# EAGLE schematic firefist (EAGLE 8.2.1)
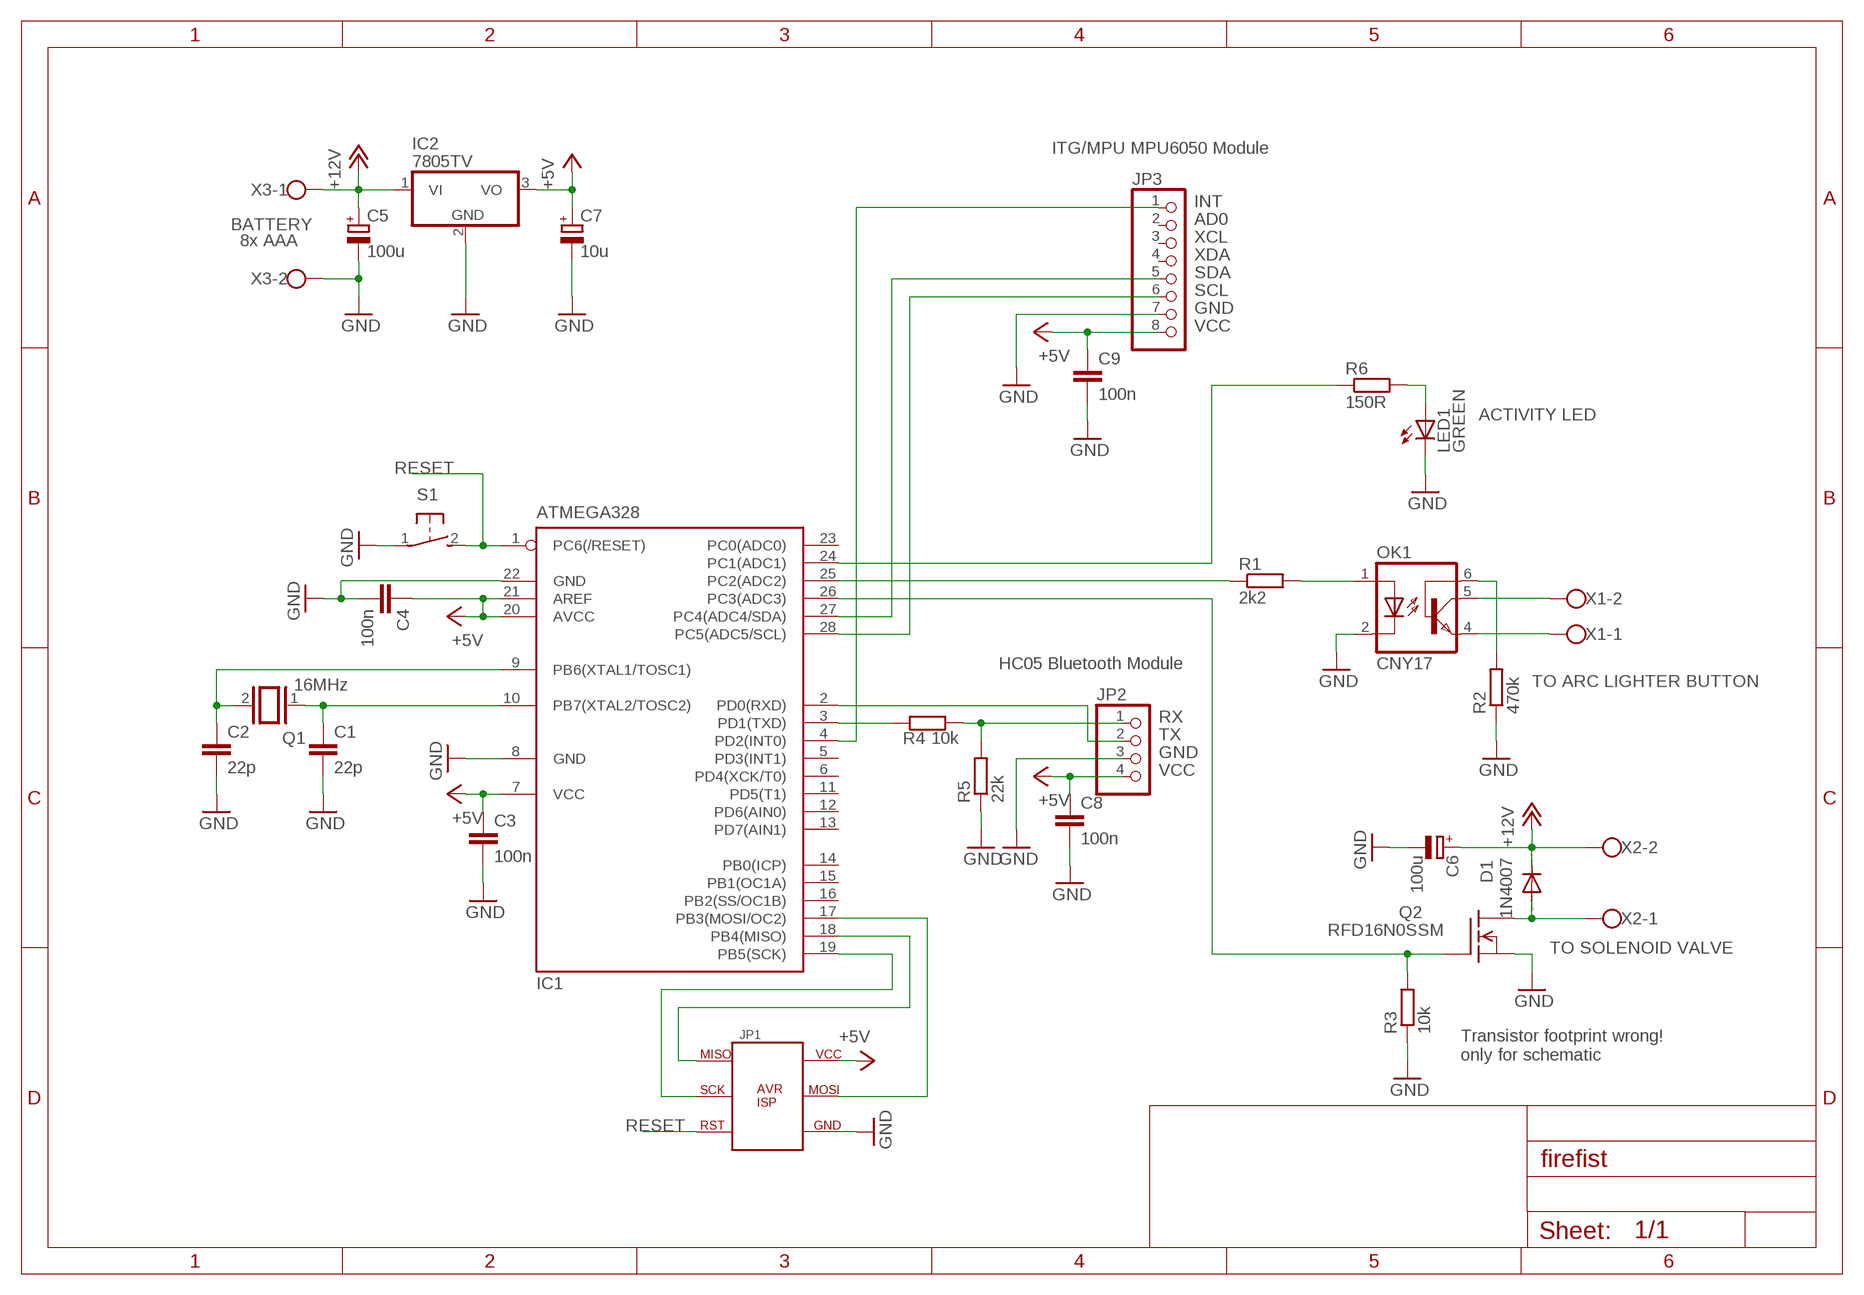
[diagram p0: schematic, sheet 1]

## Parts
C1  22p  C-EU025-024X044  [C025-024X044]
C2  22p  C-EU025-024X044  [C025-024X044]
C3  100n  C-EU025-024X044  [C025-024X044]
C4  100n  C-EU025-024X044  [C025-024X044]
C5  100u  CPOL-EUE5-13  [E5-13]
C6  100u  CPOL-EUE5-13  [E5-13]
C7  10u  CPOL-EUE2.5-7  [E2,5-7]
C8  100n  C-EU025-024X044  [C025-024X044]
C9  100n  C-EU025-024X044  [C025-024X044]
D1  1N4007  1N4004  [DO41-10]
IC1  ATMEGA328  MEGA8-P  [DIL28-3]
IC2  7805TV  [TO220V]
JP1  AVR_ISPSINGLESIDED_SMD  [PINHEADER_254_2X3_SMD]
JP2  PINHD-1X4  [1X04]
JP3  PINHD-1X8  [1X08]
LED1  GREEN  LED5MM  [LED5MM]
OK1  CNY17  [DIL06]
Q1  16MHz  XTAL/S  [QS]
Q2  RFD16N0SSM  BUZ11  [TO220]
R1  2k2  R-EU_0204/7  [0204/7]
R2  470k  R-EU_0204/7  [0204/7]
R3  10k  R-EU_0204/7  [0204/7]
R4  10k  R-EU_0204/7  [0204/7]
R5  22k  R-EU_0204/7  [0204/7]
R6  150R  R-EU_0204/7  [0204/7]
S1  31-XX  [B3F-31XX]
X1  W237-102  [W237-102]
X2  W237-102  [W237-102]
X3  W237-102  [W237-102]

## Nets
+5V: C3.1 C4.1 C7.+ C8.1 C9.1 IC1.7(VCC) IC1.20(AVCC) IC1.21(AREF) IC2.3(VO) JP1.P$8(VCC) JP2.4
+12V: C5.+ C6.+ D1.C IC2.1(VI) X2.2 X3.1
GND: C1.2 C2.2 C3.2 C4.2 C5.- C6.- C7.- C8.2 C9.2 IC1.8(GND) IC1.22(GND) IC2.2(GND) JP1.P$6(GND) JP2.3 JP3.7 LED1.K(C) OK1.2(C) Q2.3(S) R2.1 R3.1 R5.1 S1.1(P) X3.2
N$1: C2.1 IC1.9(PB6(XTAL1/TOSC1)) Q1.2
N$2: C1.1 IC1.10(PB7(XTAL2/TOSC2)) Q1.1
N$3: IC1.17(PB3(MOSI/OC2)) JP1.P$7(MOSI)
N$4: IC1.18(PB4(MISO)) JP1.P$1(MISO)
N$5: IC1.19(PB5(SCK)) JP1.P$2(SCK)
N$6: IC1.25(PC2(ADC2)) R1.1
N$7: OK1.1(A) R1.2
N$8: OK1.4(EMI) X1.1
N$9: OK1.5(COL) X1.2
N$10: OK1.6(BAS) R2.2
N$11: D1.A Q2.2(D) X2.1
N$12: IC1.26(PC3(ADC3)) Q2.1(G) R3.2
N$13: IC1.4(PD2(INT0)) JP3.1
N$14: IC1.27(PC4(ADC4/SDA)) JP3.5
N$15: IC1.28(PC5(ADC5/SCL)) JP3.6
N$16: IC1.2(PD0(RXD)) JP2.2
N$17: IC1.3(PD1(TXD)) R4.1
N$18: JP2.1 R4.2 R5.2
N$19: IC1.24(PC1(ADC1)) R6.1
N$20: LED1.A R6.2
RESET: IC1.1(PC6(/RESET)) JP1.P$3(RST) S1.2(S)
Unconnected: IC1.5(PD3(INT1)) IC1.6(PD4(XCK/T0)) IC1.11(PD5(T1)) IC1.12(PD6(AIN0)) IC1.13(PD7(AIN1)) IC1.14(PB0(ICP)) IC1.15(PB1(OC1A)) IC1.16(PB2(SS/OC1B)) IC1.23(PC0(ADC0)) JP3.2 JP3.3 JP3.4 JP3.8

## Notes on the sheet
- ITG/MPU MPU6050 Module
- INT
- AD0
- BATTERY
- 8x AAA | XCL
- XDA
- SDA
- SCL
- GND
- VCC
- ACTIVITY LED
- HC05 Bluetooth Module
- TO ARC LIGHTER BUTTON
- RX
- TX
- GND
- VCC
- TO SOLENOID VALVE
- Transistor footprint wrong!
  only for schematic

## Library data of the parts
C1-C4 C8 C9 = rcl:C-EU: CAPACITOR, European symbol
C5-C7 = rcl:CPOL-EU: POLARIZED CAPACITOR, European symbol
D1 = diode:1N4004: DIODE general purpose rectifier, 1 A
IC1 = atmel:MEGA8-P: MICROCONTROLLER 8 Kbytes FLASH, 1 kbytes SRAM, 512 bytes EEPROM, USART, 4-channel 10 bit ADC, 2-channel 8 bit ADC Pin compatible with Atmega48, ATMega88, ATMega168 Source: avr.lbr; OC_FARNELL: unknown; OC_NEWARK: unknown
IC2 = linear:78*: Positive VOLTAGE REGULATOR Source: http://cache.national.com/ds/LM/LM78L05.pdf http://www.fairchildsemi.com/ds/LM/LM7805.pdf
JP1 = stoneTronics:AVR_ISP
JP2 = pinhead:PINHD-1X4: PIN HEADER
JP3 = pinhead:PINHD-1X8: PIN HEADER
LED1 = led:LED: LED OSRAM: - CHIPLED LG R971, LG N971, LY N971, LG Q971, LY Q971, LO R971, LY R971 LH N974, LH R974 LS Q976, LO Q976, LY Q976 LO Q996 - Hyper CHIPLED LW Q18S LB Q993, LB Q99A, LB R99A - SideLED LS A670, LO A670, LY A670, LG A670, LP A670 LB A673, LV A673, LT A673, LW A673 LH A674 LY A675 LS A676, LA A676, LO A676, LY A676, LW A676 LS A679, LY A679, LG A679 - Hyper Micro SIDELED® LS Y876, LA Y876, LO Y876, LY Y876 LT Y87S - SmartLED LW L88C, LW L88S LB L89C, LB L89S, LG L890 LS L89K, LO L89K, LY L89K LS L896, LA L896, LO L896, LY L896 - TOPLED LS T670, LO T670, LY T670, LG T670, LP T670 LSG T670, LSP T670, LSY T670, LOP T670, LYG T670 LG T671, LOG T671, LSG T671 LB T673, LV T673, LT T673, LW T673 LH T674 LS T676, LA T676, LO T676, LY T676, LB T676, LH T676, LSB T676, LW T676 LB T67C, LV T67C, LT T67C, LS T67K, LO T67K, LY T67K, LW E67C LS E67B, LA E67B, LO E67B, LY E67B, LB E67C, LV E67C, LT E67C LW T67C LS T679, LY T679, LG T679 LS T770, LO T770, LY T770, LG T770, LP T770 LB T773, LV T773, LT T773, LW T773 LH T774 LS E675, LA E675, LY E675, LS T675 LS T776, LA T776, LO T776, LY T776, LB T776 LHGB T686 LT T68C, LB T68C - Hyper Mini TOPLED® LB M676 - Mini TOPLED Santana® LG M470 LS M47K, LO M47K, LY M47K Source: http://www.osram.convergy.de LUXEON: - LUMILED® LXK2-PW12-R00, LXK2-PW12-S00, LXK2-PW14-U00, LXK2-PW14-V00 LXK2-PM12-R00, LXK2-PM12-S00, LXK2-PM14-U00 LXK2-PE12-Q00, LXK2-PE12-R00, LXK2-PE12-S00, LXK2-PE14-T00, LXK2-PE14-U00 LXK2-PB12-K00, LXK2-PB12-L00, LXK2-PB12-M00, LXK2-PB14-N00, LXK2-PB14-P00, LXK2-PB14-Q00 LXK2-PR12-L00, LXK2-PR12-M00, LXK2-PR14-Q00, LXK2-PR14-R00 LXK2-PD12-Q00, LXK2-PD12-R00, LXK2-PD12-S00 LXK2-PH12-R00, LXK2-PH12-S00 LXK2-PL12-P00, LXK2-PL12-Q00, LXK2-PL12-R00 Source: www.luxeon.com KINGBRIGHT: KA-3528ASYC Source: www.kingbright.com
OK1 = optocoupler:CNY17: SIEMENS OPTO COUPLER; MPN: CNY17-1; OC_FARNELL: 1045399; OC_NEWARK: 05M4044
Q1 = special:XTAL/S: CRYSTAL
Q2 = transistor-fet:BUZ11: N-Channel Enhancement MOSFET 50V; 30A; 0,040Ohm
R1-R6 = rcl:R-EU_: RESISTOR, European symbol
S1 = switch-omron:31-XX: OMRON SWITCH; MPN: B3F-3100; OC_FARNELL: 959704; OC_NEWARK: 36M3582
X1-X3 = con-wago-500:W237-102: WAGO SCREW CLAMP; MPN: 237-102; OC_FARNELL: unknown; OC_NEWARK: 70K9898